# Altium schematic sheet CAN.SchDoc
size A2
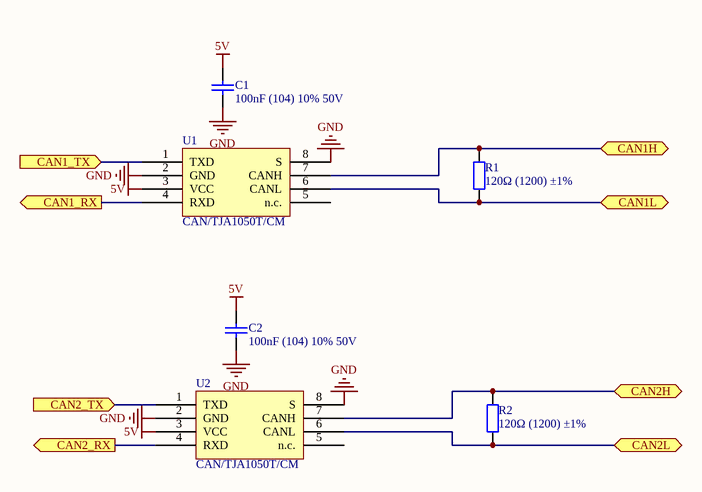
[diagram p0: CAN.SchDoc]

## Parts
C1  100nF (104) 10% 50V  [0603_C]
C2  100nF (104) 10% 50V  [0603_C]
R1  120Ω (1200) ±1%  [0603_R]
R2  120Ω (1200) ±1%  [0603_R]
U1  CAN/TJA1050T/CM  [SOIC-8_150mil]
U2  CAN/TJA1050T/CM  [SOIC-8_150mil]

## Ports
CAN1_RX (out), CAN1_TX (in), CAN1H (bidir), CAN1L (bidir), CAN2_RX (out), CAN2_TX (in), CAN2H (bidir), CAN2L (bidir)

## Nets
5V: C1.2 C2.2 U1.3(VCC) U2.3(VCC)
GND: C1.1 C2.1 U1.2(GND) U1.8(S) U2.2(GND) U2.8(S)
CAN1_RX: U1.4(RXD) ; port CAN1_RX
CAN1_TX: U1.1(TXD) ; port CAN1_TX
CAN1H: R1.2 U1.7(CANH) ; port CAN1H
CAN1L: R1.1 U1.6(CANL) ; port CAN1L
CAN2_RX: U2.4(RXD) ; port CAN2_RX
CAN2_TX: U2.1(TXD) ; port CAN2_TX
CAN2H: R2.2 U2.7(CANH) ; port CAN2H
CAN2L: R2.1 U2.6(CANL) ; port CAN2L

Not connected (* = marked no-connect by the designer): U1 5(n.c.); U2 5(n.c.)

## Library data of the parts
C1 C2 = 0603 100nF (104) 10% 50V: 贴片电容; ComponentLink1Description: 供应商链接; ComponentLink1URL: http://www.szlcsc.com/product/details_15331.html; Package: 0603; Supplier: LC; SuppliersPartNumber: C14663
R1 R2 = 0603 120Ω (1200) 1%: 贴片电阻; ComponentLink1Description: 供应商链接; ComponentLink1URL: http://www.szlcsc.com/product/details_23514.html; Package: 0603; Supplier: LC; SuppliersPartNumber: C22787
U1 U2 = CAN/TJA1050T/CM_[C6952]: CAN; ComponentLink1Description: 供应商链接; ComponentLink1URL: http://www.szlcsc.com/product/details_7424.html; Package: SOIC-8_150mil; Supplier: LC; SuppliersPartNumber: C6952